# EAGLE design SEGmeterShield (EAGLE 5.11)
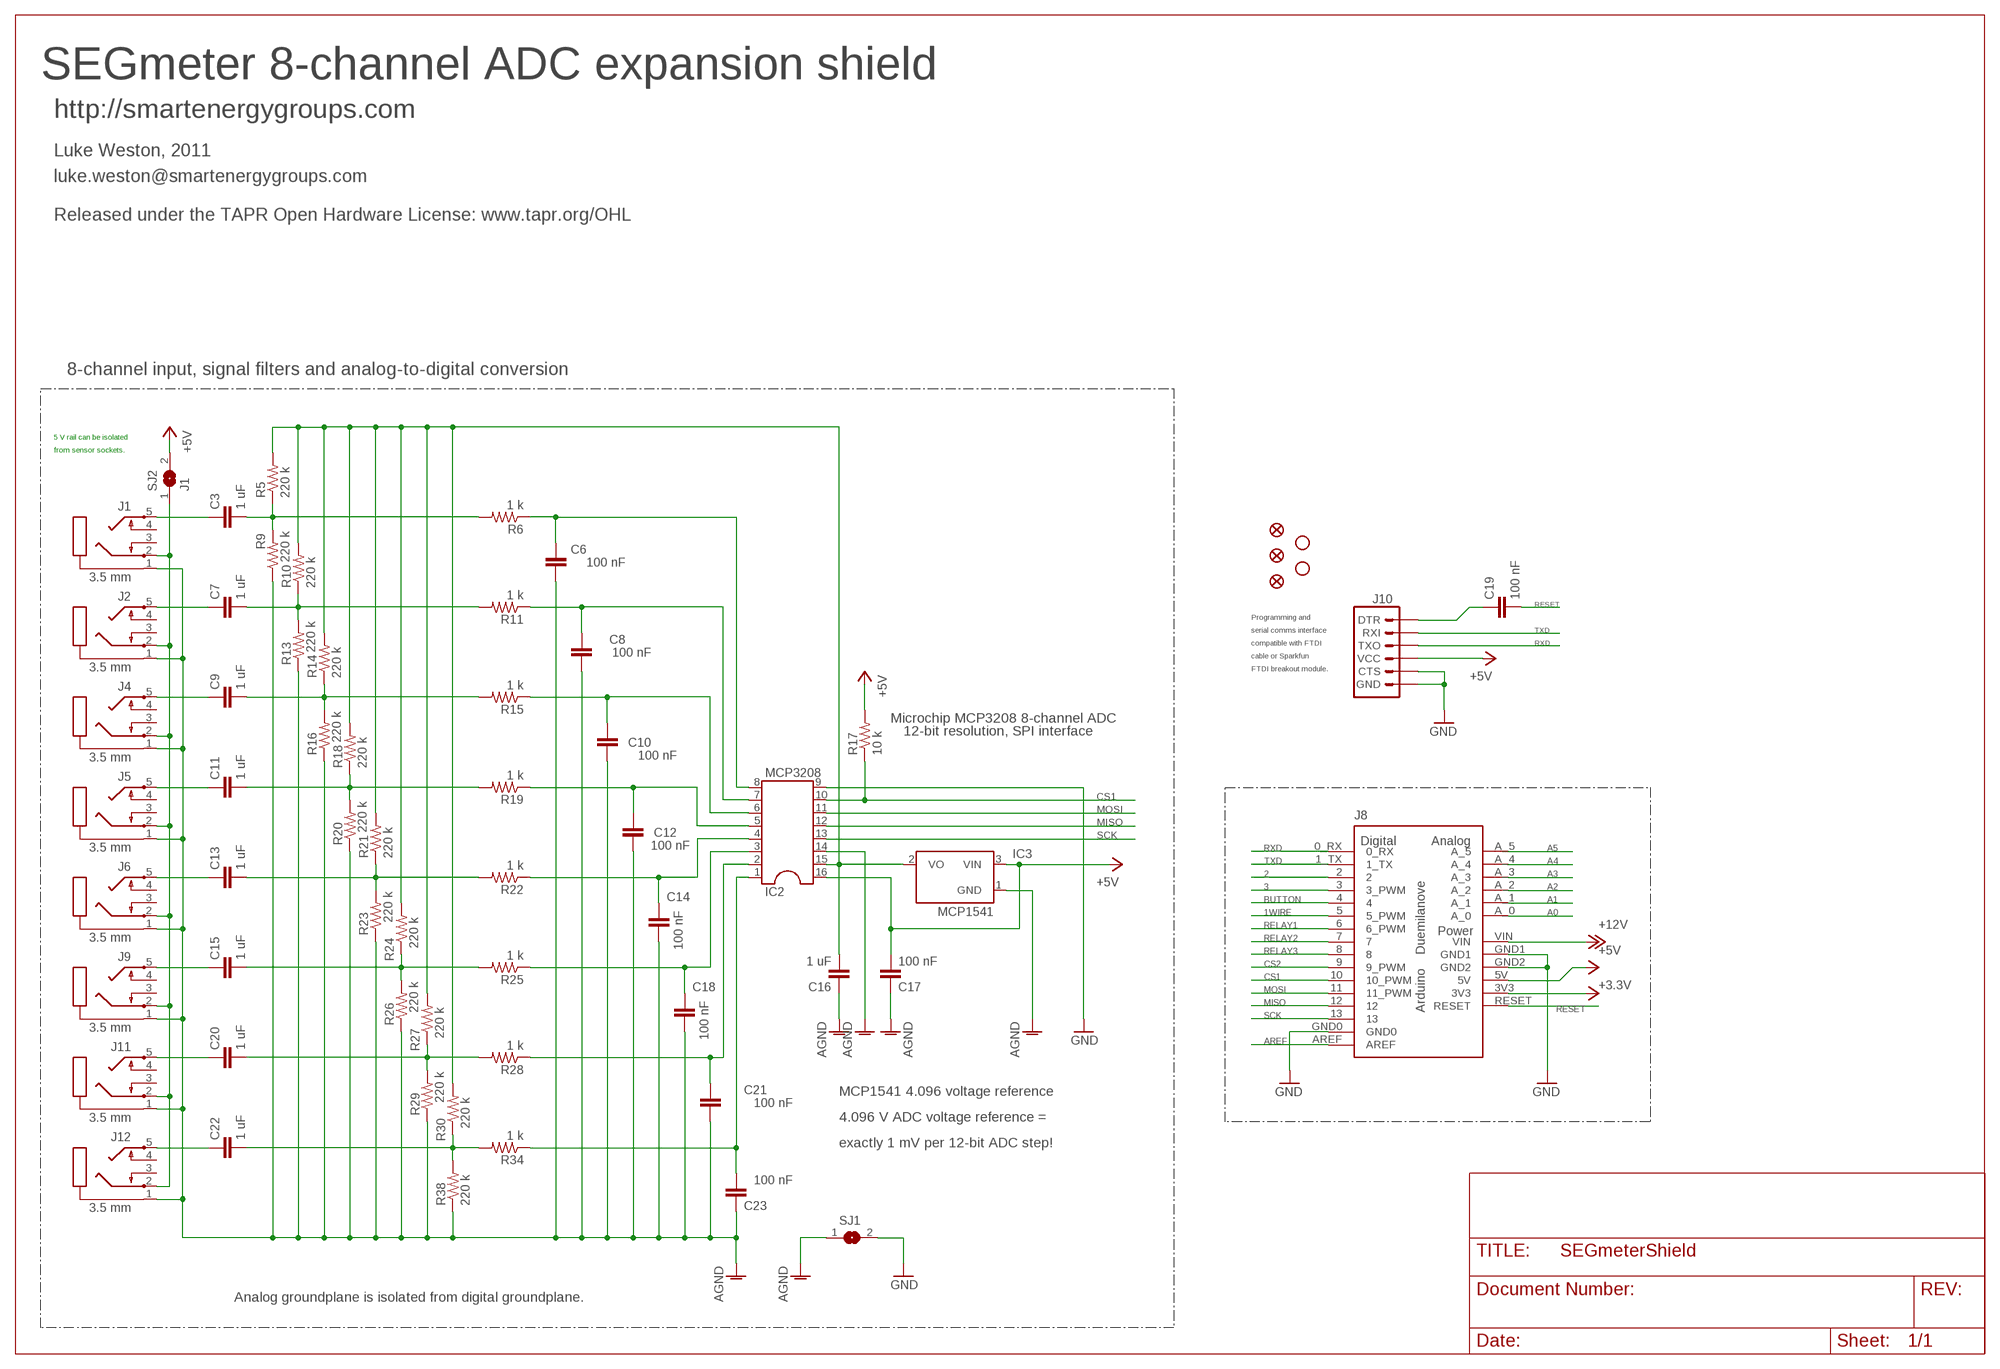
[diagram p0: schematic, sheet 1]

## Parts
C3  1 uF  C-EU050-024X044  [C050-024X044]
C6  100 nF  C-EU050-024X044  [C050-024X044]
C7  1 uF  C-EU050-024X044  [C050-024X044]
C8  100 nF  C-EU050-024X044  [C050-024X044]
C9  1 uF  C-EU050-024X044  [C050-024X044]
C10  100 nF  C-EU050-024X044  [C050-024X044]
C11  1 uF  C-EU050-024X044  [C050-024X044]
C12  100 nF  C-EU050-024X044  [C050-024X044]
C13  1 uF  C-EU050-024X044  [C050-024X044]
C14  100 nF  C-EU050-024X044  [C050-024X044]
C15  1 uF  C-EU050-024X044  [C050-024X044]
C16  1 uF  C-EU050-024X044  [C050-024X044]
C17  100 nF  C-EU050-024X044  [C050-024X044]
C18  100 nF  C-EU050-024X044  [C050-024X044]
C19  100 nF  C-EU050-024X044  [C050-024X044]
C20  1 uF  C-EU050-024X044  [C050-024X044]
C21  100 nF  C-EU050-024X044  [C050-024X044]
C22  1 uF  C-EU050-024X044  [C050-024X044]
C23  100 nF  C-EU050-024X044  [C050-024X044]
IC2  MCP3208  DIL16  [DIL16]
IC3  MCP1541  MC1541TO  [TO92]
J1  3.5 mm  PG203J  [PG203J]
J2  3.5 mm  PG203J  [PG203J]
J4  3.5 mm  PG203J  [PG203J]
J5  3.5 mm  PG203J  [PG203J]
J6  3.5 mm  PG203J  [PG203J]
J8  ARDUINO-USBNO-OUTLINE-NO-TEXT-OCTAGONAL  [NO-OUTLINE-OCTAGONAL-NOTEXT]
J9  3.5 mm  PG203J  [PG203J]
J10  Comms  ARDUINO_SERIAL_PROGRAMLONGPADS  [1X06_LONGPADS]
J11  3.5 mm  PG203J  [PG203J]
J12  3.5 mm  PG203J  [PG203J]
JP1  STAND-OFF  [STAND-OFF]
JP2  FIDUCIAL1.5X3  [FIDUCIAL-1.5X3]
JP3  FIDUCIAL1.5X3  [FIDUCIAL-1.5X3]
JP4  FIDUCIAL1.5X3  [FIDUCIAL-1.5X3]
JP5  STAND-OFF  [STAND-OFF]
R5  220 k  R-US_0207/10  [0207/10]
R6  1 k  R-US_0207/10  [0207/10]
R9  220 k  R-US_0207/10  [0207/10]
R10  220 k  R-US_0207/10  [0207/10]
R11  1 k  R-US_0207/10  [0207/10]
R13  220 k  R-US_0207/10  [0207/10]
R14  220 k  R-US_0207/10  [0207/10]
R15  1 k  R-US_0207/10  [0207/10]
R16  220 k  R-US_0207/10  [0207/10]
R17  10 k  R-US_0207/10  [0207/10]
R18  220 k  R-US_0207/10  [0207/10]
R19  1 k  R-US_0207/10  [0207/10]
R20  220 k  R-US_0207/10  [0207/10]
R21  220 k  R-US_0207/10  [0207/10]
R22  1 k  R-US_0207/10  [0207/10]
R23  220 k  R-US_0207/10  [0207/10]
R24  220 k  R-US_0207/10  [0207/10]
R25  1 k  R-US_0207/10  [0207/10]
R26  220 k  R-US_0207/10  [0207/10]
R27  220 k  R-US_0207/10  [0207/10]
R28  1 k  R-US_0207/10  [0207/10]
R29  220 k  R-US_0207/10  [0207/10]
R30  220 k  R-US_0207/10  [0207/10]
R34  1 k  R-US_0207/10  [0207/10]
R38  220 k  R-US_0207/10  [0207/10]
SJ1  SJ  [SJ]
SJ2  J1  SJ  [SJ]

## Nets
1WIRE: J8.5(5_PWM)
2: J8.2
3: J8.3(3_PWM)
+3.3V: J8.3V3
+5V: C17.2 IC2.16 IC3.3(VIN) J8.5V J10.4(VCC) R17.2 SJ2.2
+12V: J8.VIN
A0: J8.A_0
A1: J8.A_1
A2: J8.A_2
A3: J8.A_3
A4: J8.A_4
A5: J8.A_5
AGND: C6.1 C8.1 C10.1 C12.1 C14.1 C16.1 C17.1 C18.1 C21.1 C23.1 IC2.14 IC3.1(GND) J1.1 J2.1 J4.1 J5.1 J6.1 J9.1 J11.1 J12.1 R9.1 R13.1 R16.1 R20.1 R23.1 R26.1 R29.1 R38.1 SJ1.1
AREF: J8.AREF
BUTTON: J8.4
CS1: IC2.10 J8.10(10_PWM) R17.1
CS2: J8.9(9_PWM)
GND: IC2.9 J8.GND0 J8.GND1 J8.GND2 J10.5(CTS) J10.6(GND) SJ1.2
MISO: IC2.12 J8.12
MOSI: IC2.11 J8.11(11_PWM)
N$1: C3.2 R5.1 R6.2 R9.2
N$2: C20.1 J11.5
N$3: C22.1 J12.5
N$4: C16.2 IC2.15 IC3.2(VO) R5.2 R10.2 R14.2 R18.2 R21.2 R24.2 R27.2 R30.2
N$5: C7.2 R10.1 R11.2 R13.2
N$6: C6.2 IC2.8 R6.1
N$7: C15.1 J9.5
N$8: C13.1 J6.5
N$9: C11.1 J5.5
N$10: C3.1 J1.5
N$11: C7.1 J2.5
N$12: C9.1 J4.5
N$13: C8.2 IC2.7 R11.1
N$14: C10.2 IC2.6 R15.1
N$15: C12.2 IC2.5 R19.1
N$16: C23.2 IC2.1 R34.1
N$17: C21.2 IC2.2 R28.1
N$18: C15.2 R24.1 R25.2 R26.2
N$19: C18.2 IC2.3 R25.1
N$20: C14.2 IC2.4 R22.1
N$21: C22.2 R30.1 R34.2 R38.2
N$22: C20.2 R27.1 R28.2 R29.2
N$24: C13.2 R21.1 R22.2 R23.2
N$26: C11.2 R18.1 R19.2 R20.2
N$27: C9.2 R14.1 R15.2 R16.2
N$30: C19.1 J10.1(DTR)
N$69: J1.2 J2.2 J4.2 J5.2 J6.2 J9.2 J11.2 J12.2 SJ2.1
RELAY1: J8.6(6_PWM)
RELAY2: J8.7
RELAY3: J8.8
RESET: C19.2 J8.RESET
RXD: J8.0_RX J10.3(TXO)
SCK: IC2.13 J8.13
TXD: J8.1_TX J10.2(RXI)
Unconnected: J1.3 J1.4 J2.3 J2.4 J4.3 J4.4 J5.3 J5.4 J6.3 J6.4 J9.3 J9.4 J11.3 J11.4 J12.3 J12.4

## Notes on the sheet
- SEGmeter 8-channel ADC expansion shield
- http://smartenergygroups.com
- Luke Weston, 2011
- luke.weston@smartenergygroups.com
- Released under the TAPR Open Hardware License: www.tapr.org/OHL
- 8-channel input, signal filters and analog-to-digital conversion
- 5 V rail can be isolated
- from sensor sockets.
- Programming and
- serial comms interface
- compatible with FTDI
- cable or Sparkfun
- FTDI breakout module.
- Microchip MCP3208 8-channel ADC
- 12-bit resolution, SPI interface
- MCP1541 4.096 voltage reference
- 4.096 V ADC voltage reference =
- exactly 1 mV per 12-bit ADC step!
- Analog groundplane is isolated from digital groundplane.

## Library data of the parts
C3 C6-C23 = rcl:C-EU: CAPACITOR, European symbol
IC2 = ic-package:DIL16: Dual In Line / Socket
IC3 = microchip:MC15*: 2.5V and 4.096V Voltage References Source: http://www.microchip.com .. 21653b.pdf; OC_FARNELL: unknown; OC_NEWARK: unknown
J1 J2 J4-J6 J9 J11 J12 = con-hirschmann:PG203J: MIC/HEADPHONE JACK KS-S stereo microphone/headphone jack PG203JN (Schukat); OC_FARNELL: unknown; OC_NEWARK: unknown
J8 = Arduino-Various:ARDUINO-USB: The Ardiuno Duemilanove Pinouts layoutet as a Bare Shield. v0.5 Also for Arduino Diecimila. This is designed as a Part and has no Outline in the Dimension Layer. The Outline, when present, is drawed at the tPlace / bPlace Layer. Library by Stephanie Lange, http://www.k-ita.de/~sl/
J10 = SparkFun:ARDUINO_SERIAL_PROGRAM
JP1 JP5 = SparkFun:STAND-OFF: Stand Off This is the mechanical footprint for a #4 phillips button head screw. Use the keepout ring to avoid running the screw head into surrounding components. SKU : PRT-00447
JP2-JP4 = SparkFun:FIDUCIAL: Fiducial Alignment Points Various fiducial points for machine vision alignment.
R5 R6 R9-R11 R13-R30 R34 R38 = rcl:R-US_: RESISTOR, American symbol
SJ1 SJ2 = jumper:SJ: SMD solder JUMPER

## Board
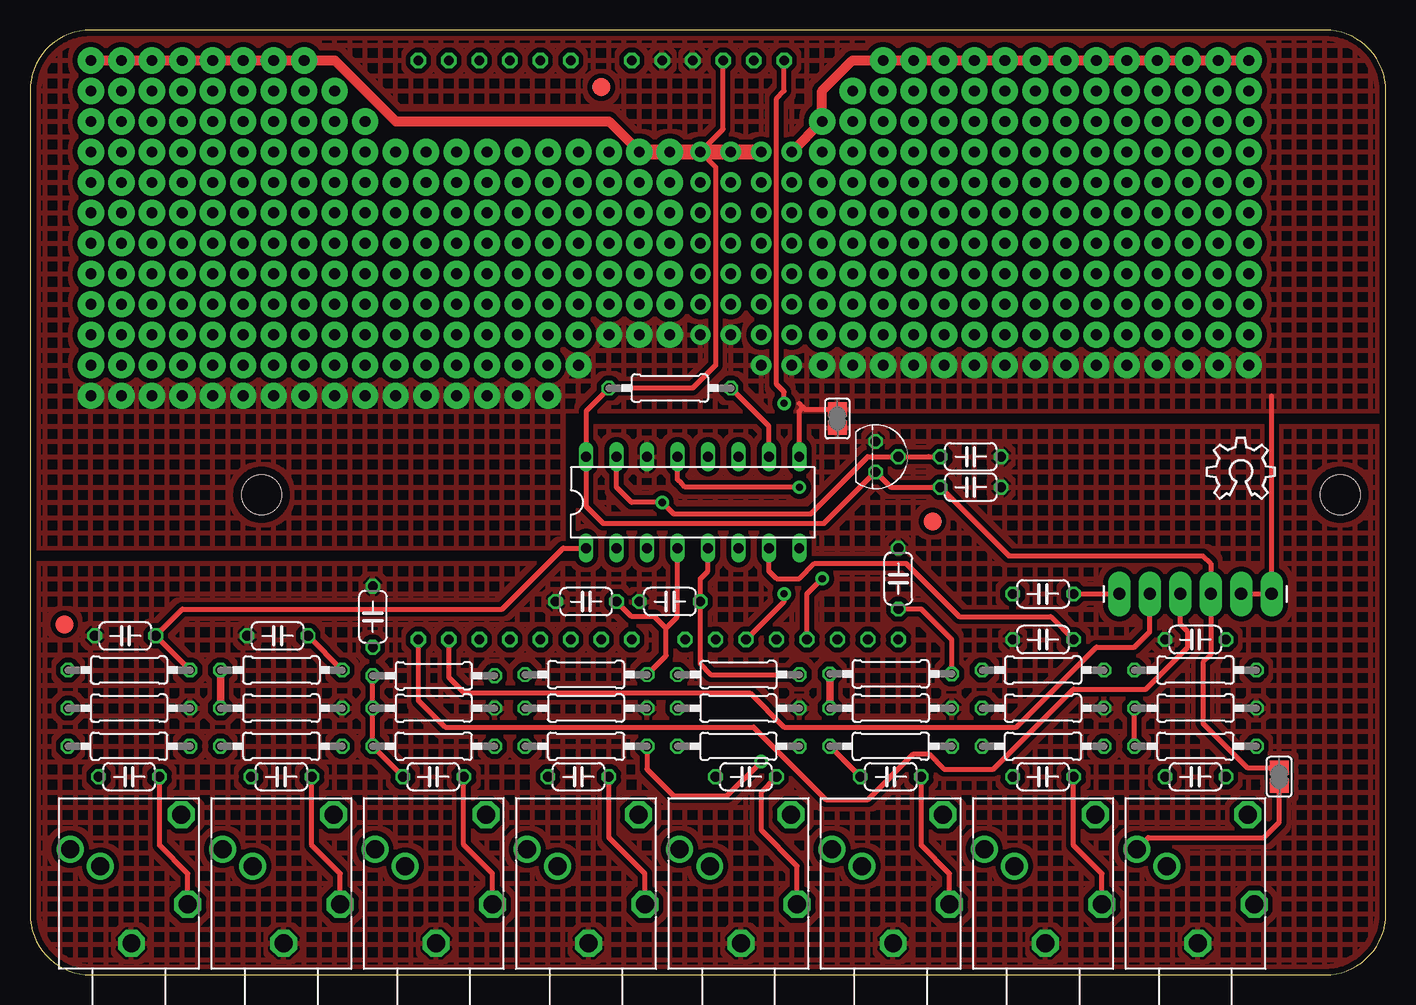
[diagram p1: board, top side]
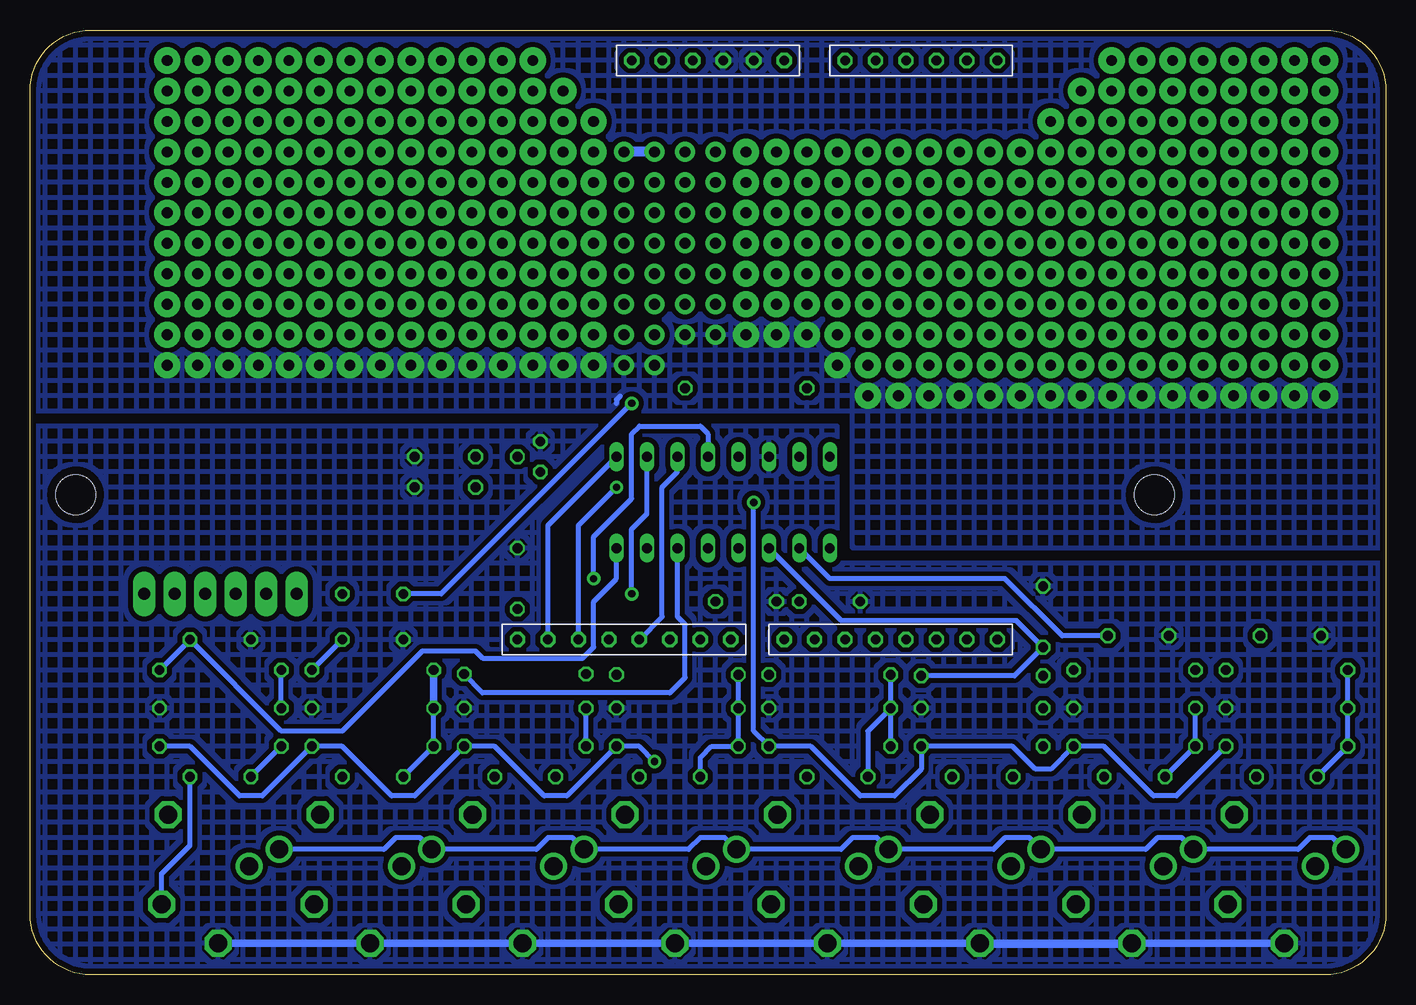
[diagram p2: board, bottom side, seen from below]

Size 113.03 x 78.74 mm. Coordinates in mm from the lower left corner, seen from the top.
Outline: 107.95,0 arc90 113.03,5.08 113.03,73.66 arc90 107.95,78.74 5.08,78.74 arc90 0,73.66 0,5.08 arc90 5.08,0 107.95,0
Copper layers (1*16): Top 0.035mm / dielectric 1.5mm / Bottom 0.035mm
Design rules "PCBCart-Standard": minimum track width 8mil, minimum drill 0.4mm, track to track 8mil, track to pad 8mil, pad to pad 8mil, via to via 8mil, smd to smd 8mil, copper to edge 20mil, drill to drill 8mil, minimum pad ring 8mil, minimum via ring 10mil, stop-mask expansion 3mil, vias tented up to drill 0mil, thermal gap 8mil

### Footprints (pad centres in the part's own frame; a part is rotated, then mirrored left to right if it is on the bottom)
C050-024X044 = drill 0.813 octagon: 1 -2.54,0; 2 2.54,0
DIL16 = drill 0.813 long: 1 -8.89,-3.81; 2 -6.35,-3.81; 3 -3.81,-3.81; 4 -1.27,-3.81; 5 1.27,-3.81; 6 3.81,-3.81; 7 6.35,-3.81; 8 8.89,-3.81; 9 8.89,3.81; 10 6.35,3.81; 11 3.81,3.81; 12 1.27,3.81; 13 -1.27,3.81; 14 -3.81,3.81; 15 -6.35,3.81; 16 -8.89,3.81
TO92 = drill 0.813 octagon: 1 -1.27,0; 2 0,1.905; 3 1.27,0
PG203J = drill 1.499 octagon: 1 -5.004,-0.203; 4 5.74,-4.369; 5 -1.753,-4.902 | drill 1.499 round: 2 2.845,4.902; 3 1.448,2.388
NO-OUTLINE-OCTAGONAL-NOTEXT = drill 0.8 pad 1.27 octagon: 0_RX -25.4,27.94; 1_TX -25.4,25.4; 2 -25.4,22.86; 3 -25.4,20.32; 3V3 22.86,0; 4 -25.4,17.78; 5 -25.4,15.24; 5V 22.86,2.54; 6 -25.4,12.7; 7 -25.4,10.16; 8 -25.4,5.715; 9 -25.4,3.175; 10 -25.4,0.635; 11 -25.4,-1.905; 12 -25.4,-4.445; 13 -25.4,-6.985; A_0 22.86,15.24; A_1 22.86,17.78; A_2 22.86,20.32; A_3 22.86,22.86; A_4 22.86,25.4; A_5 22.86,27.94; AREF -25.4,-12.065; GND0 -25.4,-9.525; GND1 22.86,7.62; GND2 22.86,5.08; RESET 22.86,-2.54; VIN 22.86,10.16
1X06_LONGPADS = drill 1.016 pad 1.88 long: 1 0,0; 2 2.54,0; 3 5.08,0; 4 7.62,0; 5 10.16,0; 6 12.7,0
STAND-OFF = hole 3.302: 0,0
FIDUCIAL-1.5X3 = smd 1.5 x 1.5: 1 0,0
0207/10 = drill 0.813 octagon: 1 -5.08,0; 2 5.08,0
SJ = smd 1.168 x 1.6: 1 -0.762,0; 2 0.762,0

### Placement (x,y rotation side)
C3  97.16,16.51 180 top
C6  97.16,27.94 0 top
C7  84.46,16.51 180 top
C8  84.46,27.94 0 top
C9  71.76,16.51 180 top
C10  72.39,33.02 270 top
C11  59.69,16.51 180 top
C12  53.34,31.11 0 top
C13  45.72,16.51 180 top
C14  46.35,31.11 0 top
C15  33.62,16.51 180 top
C16  78.42,43.18 180 top
C17  78.42,40.64 180 top
C18  28.57,29.84 270 top
C19  84.45,31.75 180 top
C20  20.95,16.51 180 top
C21  20.64,28.26 0 top
C22  8.25,16.51 180 top
C23  7.94,28.26 0 top
IC2  55.24,39.37 0 top
IC3  70.48,43.18 270 top
J1  97.16,7.62 90 top
J2  84.46,7.62 90 top
J4  71.76,7.62 90 top
J5  59.05,7.62 90 top
J6  46.35,7.62 90 top
J8  60.32,53.34 90 top
J9  33.66,7.62 90 top
J10  90.81,31.75 0 top
J11  20.95,7.62 90 top
J12  8.25,7.62 90 top
JP1  19.3,40.01 0 top
JP2  75.25,37.78 0 top
JP3  47.62,73.98 0 top
JP4  2.86,29.21 0 top
JP5  109.22,40.01 0 top
R5  97.16,19.05 0 top
R6  97.16,25.4 180 top
R9  97.16,22.22 180 top
R10  84.46,19.05 0 top
R11  84.46,25.4 180 top
R13  84.46,22.22 180 top
R14  71.76,19.05 0 top
R15  71.76,25.08 180 top
R16  71.76,22.22 180 top
R17  53.34,48.89 180 top
R18  59.05,19.05 0 top
R19  59.05,25.02 180 top
R20  59.05,22.22 180 top
R21  46.35,19.05 0 top
R22  46.35,25.02 180 top
R23  46.35,22.22 180 top
R24  33.66,19.05 0 top
R25  33.65,24.92 180 top
R26  33.66,22.22 180 top
R27  20.95,19.05 0 top
R28  20.95,25.4 180 top
R29  20.95,22.22 180 top
R30  8.25,19.05 0 top
R34  8.25,25.4 180 top
R38  8.25,22.22 180 top
SJ1  67.31,46.35 90 top
SJ2  104.14,16.51 90 top
U$1  [OSHW_8X200_NOTEXT]  98.11,39.69 0 top

### Tracks (layer width: path | path; a pad name or v marks a point on that pad's centre or on a via)
+5V  (via drill 0.9 pad 1.68, 0.9 pad 2.18)
  Top 0.406: IC3.3 71.76,40.64 C17.2 81.6,34.92 97.79,34.92 98.43,34.29 J10.4 98.43,26.67 97.79,26.04 97.79,20.95 101.47,17.27 SJ2.2 | IC3.3 | IC3.3 66.2,37.62 47.78,37.62 46.35,39.05 IC2.16 46.35,46.99 R17.2 55.24,48.89 57.15,50.8 57.15,67.31 v55.88,68.58 57.78,70.48 J8.5V
  Top 0.813: v5.08,76.2 v7.62,76.2 v10.16,76.2 v12.7,76.2 v15.24,76.2 v17.78,76.2 v20.32,76.2 v22.86,76.2 25.4,76.2 30.48,71.12 48.26,71.12 v50.8,68.58 | v101.6,76.2 v99.06,76.2 v96.52,76.2 v93.98,76.2 v91.44,76.2 v88.9,76.2 v86.36,76.2 v83.82,76.2 v81.28,76.2 v78.74,76.2 v76.2,76.2 v73.66,76.2 v71.12,76.2 68.58,76.2 66.04,73.66 v66.04,71.12 v63.5,68.58
  Top 1.27: v50.8,68.58 v53.34,68.58 v55.88,68.58 v58.42,68.58 v60.96,68.58
  Bottom 0.406: IC3.3
  Bottom 0.813: v60.96,68.58 v63.5,68.58
AGND
  Bottom 0.61: J1.1 J2.1 J4.1 59.77,2.62 59.69,2.54 59.33,2.54 J5.1 J6.1 J9.1 | J9.1 34.21,2.62 34.29,2.54 33.02,2.54 | J9.1 J11.1 J12.1 | 33.02,2.54 21.59,2.54 | J9.1 33.1,2.62 33.02,2.54
  pour Bottom (isolate 0.406, hatched): -1.27,34.29 45.72,34.29 45.72,45.72 113.67,45.72 113.67,-0.63 -1.27,-0.63
  pour Top (isolate 0.406, hatched): -1.27,34.29 45.72,34.29 45.72,45.72 113.67,45.72 113.67,-0.63 -1.27,-0.63
CS1  (via drill 0.6)
  Top 0.406: J8.10 62.87,31.11 v62.87,31.75 | R17.1 61.59,45.72 IC2.10
  Bottom 0.406: IC2.10 61.59,38.42 62.87,37.15 v62.87,31.75
GND  (via drill 0.9 pad 1.68, 0.9 pad 2.18)
  Top 0.406: 103.51,48.26 J10.6 J10.5 | SJ1.2 64.64,47.12 64.45,47.31 | 64.45,47.31 64.14,47.62 | IC2.9 64.14,46.99 64.45,47.31
  Bottom 0.406: 63.82,48.26 64.14,47.94 64.14,47.62 | J8.GND0 69.85,37.46 IC2.9
  other vias: 5.08,48.26 7.62,48.26 10.16,48.26 12.7,48.26 15.24,48.26 17.78,48.26 40.64,48.26 43.18,48.26 35.56,48.26 38.1,48.26 30.48,48.26 33.02,48.26 27.94,48.26 25.4,48.26 22.86,48.26 20.32,48.26 63.5,50.8 60.96,50.8 58.42,53.34 55.88,53.34 48.26,53.34 45.72,50.8 50.8,53.34 53.34,53.34 66.04,50.8 68.58,50.8 71.12,50.8 73.66,50.8 76.2,50.8 78.74,50.8 81.28,50.8 83.82,50.8 86.36,50.8 88.9,50.8 91.44,50.8 93.98,50.8 96.52,50.8 99.06,50.8 101.6,50.8
  pour Bottom (isolate 0.406, hatched): -1.27,35.56 44.45,35.56 44.45,46.99 113.67,46.99 113.67,79.38 -1.32,79.4
  pour Top (isolate 0.406, hatched): -1.27,79.69 113.98,79.69 113.98,46.99 44.45,46.99 44.45,35.56 -1.27,35.56
MISO  (via drill 0.6)
  Top 0.406: J8.12 64.77,31.75 v66.04,33.02
  Bottom 0.406: v66.04,33.02 66.04,36.51 62.87,39.69 62.87,45.09 62.23,45.72 57.15,45.72 56.52,45.09 IC2.12
MOSI
  Bottom 0.406: IC2.11 59.05,41.91 60.32,40.64 60.32,29.84 J8.11
N$1
  Top 0.406: R5.1 R9.2
  Bottom 0.406: R5.1 C3.2 | R9.2 R6.2
N$2
  Top 0.406: J11.5 25.86,8.43 23.49,10.8 C20.1
N$3
  Top 0.406: J12.5 13.16,8.43 10.8,10.8 C22.1
N$4  (via drill 0.6)
  Top 0.406: IC2.15 48.89,40.64 50.16,39.37 v52.7,39.37 53.66,38.42 65.09,38.42 69.85,43.18 IC3.2 74.93,43.18 C16.2 | R21.2 51.44,17.14 53.66,14.92 58.1,14.92 v60.96,17.78
  Bottom 0.406: R5.2 99.7,19.05 95.57,14.92 93.66,14.92 R10.2 87,19.05 82.87,14.92 80.96,14.92 R14.2 74.3,19.05 70.17,14.92 68.26,14.92 R18.2 62.23,19.05 v60.96,17.78 | v52.7,39.37 52.7,20.32 R21.2 47.94,19.05 43.81,14.92 40.96,14.92 38.73,17.14 R24.2 31.11,19.05 29.21,17.14 27.94,17.14 R27.2 23.49,19.05 19.37,14.92 17.46,14.92 R30.2
N$5
  Bottom 0.406: R13.2 R10.1 C7.2
  Bottom 0.61: R13.2 R11.2
N$6
  Bottom 0.406: R6.1 C6.2 92.08,20.32 87,20.32 80.33,26.99 75.88,26.99 75.25,26.35 66.99,26.35 66.04,27.3 66.04,31.11 64.14,33.02 IC2.8
N$7
  Top 0.406: J9.5 38.56,8.43 36.2,10.8 36.16,10.83 C15.1
N$8
  Top 0.406: J6.5 51.26,8.43 48.26,11.43 C13.1
N$9
  Top 0.406: J5.5 63.96,9.07 60.96,12.07 60.96,15.24 C11.1
N$10
  Bottom 0.406: J1.5 102.06,8.43 99.7,10.8 C3.1
N$11
  Top 0.406: J2.5 89.36,8.43 87,10.8 C7.1
N$12
  Top 0.406: J4.5 76.66,8.43 74.3,10.8 C9.1
N$13
  Top 0.406: IC2.7 61.59,33.66 62.23,33.02 64.14,33.02 65.41,34.29 73.03,34.29 77.47,29.84 85.09,29.84 C8.2
  Bottom 0.406: C8.2 R11.1
N$14
  Top 0.406: R15.1 76.84,27.94 74.3,30.48 C10.2 | C10.2
  Bottom 0.406: IC2.6 59.05,29.84 58.42,29.21 58.42,24.77 59.69,23.49 75.31,23.49 R15.1
N$15
  Top 0.406: IC2.5 56.52,33.66 55.88,33.02 C12.2 55.88,25.91 56.77,25.02 R19.1
N$16
  Top 0.406: R34.1 C23.2 12.7,30.48 39.37,30.48 44.45,35.56 IC2.1
N$17
  Top 0.406: C21.2 R28.1
  Bottom 0.406: IC2.2 46.35,33.02 31.75,33.02 26.99,28.26 C21.2
N$18
  Top 0.406: R26.2 R25.2 | R26.2 | R26.2 R24.1 31.08,16.54 C15.2
N$19
  Bottom 0.406: IC2.3 45.4,29.53 30.8,29.53 C18.2 30.96,24.92 R25.1
N$20
  Top 0.406: IC2.4 53.98,29.84 53.02,28.89 | 53.02,28.89 53.02,26.61 R22.1 | C14.2 50.16,29.84 52.07,29.84 53.02,28.89
N$21
  Bottom 0.406: C22.2 R30.1 R38.2 R34.2
N$22
  Top 0.61: R29.2 R28.2
  Bottom 0.406: R29.2 R27.1 C20.2
N$23  (via drill 0.9 pad 2.18)
  other vias: 5.08,73.66
N$24
  Bottom 0.406: R21.1 R23.2 | R23.2 R22.2 | C13.2 43.18,20.32 R23.2
N$25  (via drill 0.9 pad 2.18)
  other vias: 7.62,73.66
N$26
  Bottom 0.406: R19.2 R20.2 R18.1 56.2,19.05 57.15,18.1 C11.2
N$27
  Top 0.406: R14.1 C9.2
  Top 0.61: R16.2 R15.2
  Bottom 0.406: R14.1 R16.2
N$28  (via drill 0.9 pad 2.18)
  other vias: 5.08,71.12
N$29  (via drill 0.9 pad 2.18)
  other vias: 5.08,68.58
N$30
  Top 0.406: C19.1 J10.1
  Top 0.61: J10.1
N$31  (via drill 0.9 pad 2.18)
  other vias: 5.08,66.04
N$32  (via drill 0.9 pad 2.18)
  other vias: 45.72,66.04
N$33  (via drill 0.9 pad 2.18)
  other vias: 45.72,63.5
N$34  (via drill 0.9 pad 2.18)
  other vias: 45.72,60.96
N$35  (via drill 0.9 pad 2.18)
  other vias: 45.72,58.42
N$36  (via drill 0.9 pad 2.18)
  other vias: 43.18,58.42
N$37  (via drill 0.9 pad 2.18)
  other vias: 40.64,58.42
N$38  (via drill 0.9 pad 2.18)
  other vias: 38.1,58.42
N$39  (via drill 0.9 pad 2.18)
  other vias: 38.1,60.96
N$40  (via drill 0.9 pad 2.18)
  other vias: 38.1,63.5
N$41  (via drill 0.9 pad 2.18)
  other vias: 35.56,66.04
N$42  (via drill 0.9 pad 2.18)
  other vias: 35.56,63.5
N$43  (via drill 0.9 pad 2.18)
  other vias: 35.56,60.96
N$44  (via drill 0.9 pad 2.18)
  other vias: 35.56,58.42
N$45  (via drill 0.9 pad 2.18)
  other vias: 38.1,66.04
N$46  (via drill 0.9 pad 2.18)
  other vias: 40.64,66.04
N$47  (via drill 0.9 pad 2.18)
  other vias: 43.18,66.04
N$48  (via drill 0.9 pad 2.18)
  other vias: 43.18,63.5
N$49  (via drill 0.9 pad 2.18)
  other vias: 40.64,63.5
N$50  (via drill 0.9 pad 2.18)
  other vias: 40.64,60.96
N$51  (via drill 0.9 pad 2.18)
  other vias: 43.18,60.96
N$52  (via drill 0.9 pad 2.18)
  other vias: 10.16,73.66
N$53  (via drill 0.9 pad 2.18)
  other vias: 5.08,63.5
N$54  (via drill 0.9 pad 2.18)
  other vias: 5.08,60.96
N$55  (via drill 0.9 pad 2.18)
  other vias: 68.58,73.66
N$56  (via drill 0.9 pad 2.18)
  other vias: 68.58,71.12
N$57  (via drill 0.9 pad 2.18)
  other vias: 68.58,68.58
N$58  (via drill 0.9 pad 2.18)
  other vias: 33.02,66.04
N$59  (via drill 0.9 pad 2.18)
  other vias: 30.48,66.04
N$60  (via drill 0.9 pad 2.18)
  other vias: 27.94,66.04
N$61  (via drill 0.9 pad 2.18)
  other vias: 25.4,66.04
N$62  (via drill 0.9 pad 2.18)
  other vias: 22.86,66.04
N$63  (via drill 0.9 pad 2.18)
  other vias: 20.32,66.04
N$64  (via drill 0.9 pad 2.18)
  other vias: 43.18,50.8
N$65  (via drill 0.9 pad 2.18)
  other vias: 45.72,53.34
N$66  (via drill 0.9 pad 2.18)
  other vias: 48.26,68.58
N$67  (via drill 0.9 pad 2.18)
  other vias: 66.04,68.58
N$68  (via drill 0.9 pad 2.18)
  other vias: 27.94,71.12
N$69
  Top 0.406: SJ2.1 104.14,12.7 102.87,11.43 93.22,11.43 J1.2
  Bottom 0.406: J12.2 3.48,10.46 4.45,11.43 6.35,11.43 7.32,10.46 J11.2 17.02,11.43 19.05,11.43 20.02,10.46 J9.2 29.72,11.43 31.75,11.43 32.72,10.46 J6.2 42.42,11.43 44.45,11.43 45.41,10.46 J5.2 55.12,11.43 57.15,11.43 58.12,10.46 J4.2 67.82,11.43 69.85,11.43 70.82,10.46 J2.2 80.52,11.43 82.55,11.43 83.52,10.46 J1.2
N$70  (via drill 0.9 pad 1.68)
  other vias: 60.96,53.34
N$71  (via drill 0.9 pad 2.18)
  other vias: 17.78,66.04
N$72  (via drill 0.9 pad 2.18)
  other vias: 5.08,50.8
N$73  (via drill 0.9 pad 2.18)
  other vias: 5.08,53.34
N$74  (via drill 0.9 pad 2.18)
  other vias: 5.08,55.88
N$75  (via drill 0.9 pad 2.18)
  other vias: 5.08,58.42
N$76  (via drill 0.9 pad 2.18)
  other vias: 15.24,66.04
N$77  (via drill 0.9 pad 2.18)
  other vias: 12.7,66.04
N$78  (via drill 0.9 pad 2.18)
  other vias: 43.18,53.34
N$79  (via drill 0.9 pad 2.18)
  other vias: 33.02,63.5
N$80  (via drill 0.9 pad 2.18)
  other vias: 33.02,60.96
N$81  (via drill 0.9 pad 2.18)
  other vias: 33.02,58.42
N$82  (via drill 0.9 pad 2.18)
  other vias: 30.48,58.42
N$83  (via drill 0.9 pad 2.18)
  other vias: 27.94,58.42
N$84  (via drill 0.9 pad 2.18)
  other vias: 27.94,60.96
N$85  (via drill 0.9 pad 2.18)
  other vias: 27.94,63.5
N$86  (via drill 0.9 pad 2.18)
  other vias: 25.4,63.5
N$87  (via drill 0.9 pad 1.68)
  other vias: 63.5,53.34
N$88  (via drill 0.9 pad 2.18)
  other vias: 25.4,60.96
N$92  (via drill 0.9 pad 2.18)
  other vias: 66.04,58.42
N$94  (via drill 0.9 pad 2.18)
  other vias: 101.6,53.34
N$95  (via drill 0.9 pad 2.18)
  other vias: 101.6,55.88
N$97  (via drill 0.9 pad 2.18)
  other vias: 101.6,73.66
N$104  (via drill 0.9 pad 2.18)
  other vias: 73.66,53.34
N$105  (via drill 0.9 pad 2.18)
  other vias: 76.2,53.34
N$106  (via drill 0.9 pad 2.18)
  other vias: 78.74,53.34
N$107  (via drill 0.9 pad 2.18)
  other vias: 81.28,53.34
N$108  (via drill 0.9 pad 2.18)
  other vias: 83.82,53.34
N$109  (via drill 0.9 pad 2.18)
  other vias: 86.36,53.34
N$110  (via drill 0.9 pad 2.18)
  other vias: 88.9,55.88
N$111  (via drill 0.9 pad 2.18)
  other vias: 91.44,55.88
N$117  (via drill 0.9 pad 2.18)
  other vias: 66.04,53.34
N$118  (via drill 0.9 pad 2.18)
  other vias: 25.4,58.42
N$119  (via drill 0.9 pad 2.18)
  other vias: 30.48,60.96
N$120  (via drill 0.9 pad 2.18)
  other vias: 30.48,63.5
N$121  (via drill 0.9 pad 2.18)
  other vias: 40.64,50.8
N$122  (via drill 0.9 pad 2.18)
  other vias: 12.7,58.42
N$123  (via drill 0.9 pad 2.18)
  other vias: 12.7,60.96
N$124  (via drill 0.9 pad 2.18)
  other vias: 7.62,50.8
N$125  (via drill 0.9 pad 2.18)
  other vias: 12.7,63.5
N$126  (via drill 0.9 pad 2.18)
  other vias: 17.78,63.5
N$127  (via drill 0.9 pad 2.18)
  other vias: 15.24,63.5
N$128  (via drill 0.9 pad 2.18)
  other vias: 15.24,60.96
N$129  (via drill 0.9 pad 2.18)
  other vias: 15.24,58.42
N$130  (via drill 0.9 pad 2.18)
  other vias: 17.78,58.42
N$131  (via drill 0.9 pad 2.18)
  other vias: 17.78,60.96
N$132  (via drill 0.9 pad 2.18)
  other vias: 20.32,60.96
N$133  (via drill 0.9 pad 2.18)
  other vias: 20.32,63.5
N$134  (via drill 0.9 pad 2.18)
  other vias: 7.62,71.12
N$135  (via drill 0.9 pad 2.18)
  other vias: 22.86,63.5
N$136  (via drill 0.9 pad 2.18)
  other vias: 22.86,60.96
N$140  (via drill 0.9 pad 2.18)
  other vias: 71.12,73.66
N$141  (via drill 0.9 pad 2.18)
  other vias: 99.06,73.66
N$142  (via drill 0.9 pad 2.18)
  other vias: 101.6,71.12
N$144  (via drill 0.9 pad 2.18)
  other vias: 68.58,53.34
N$145  (via drill 0.9 pad 2.18)
  other vias: 22.86,58.42
N$146  (via drill 0.9 pad 2.18)
  other vias: 20.32,58.42
N$147  (via drill 0.9 pad 2.18)
  other vias: 71.12,53.34
N$148  (via drill 0.9 pad 2.18)
  other vias: 101.6,58.42
N$149  (via drill 0.9 pad 2.18)
  other vias: 101.6,60.96
N$150  (via drill 0.9 pad 2.18)
  other vias: 101.6,63.5
N$151  (via drill 0.9 pad 2.18)
  other vias: 101.6,66.04
N$152  (via drill 0.9 pad 2.18)
  other vias: 101.6,68.58
N$153  (via drill 0.9 pad 2.18)
  other vias: 45.72,68.58
N$154  (via drill 0.9 pad 2.18)
  other vias: 25.4,73.66
N$155  (via drill 0.9 pad 1.68)
  other vias: 55.88,66.04
N$156  (via drill 0.9 pad 2.18)
  other vias: 66.04,66.04
N$157  (via drill 0.9 pad 1.68)
  other vias: 63.5,66.04
N$158  (via drill 0.9 pad 1.68)
  other vias: 60.96,66.04
N$159  (via drill 0.9 pad 1.68)
  other vias: 58.42,66.04
N$160  (via drill 0.9 pad 1.68)
  other vias: 55.88,55.88
N$161  (via drill 0.9 pad 1.68)
  other vias: 63.5,55.88
N$162  (via drill 0.9 pad 2.18)
  other vias: 66.04,55.88
N$163  (via drill 0.9 pad 1.68)
  other vias: 60.96,55.88
N$164  (via drill 0.9 pad 1.68)
  other vias: 58.42,55.88
N$165  (via drill 0.9 pad 1.68)
  other vias: 58.42,58.42
N$166  (via drill 0.9 pad 1.68)
  other vias: 55.88,58.42
N$167  (via drill 0.9 pad 1.68)
  other vias: 55.88,60.96
N$168  (via drill 0.9 pad 1.68)
  other vias: 55.88,63.5
N$169  (via drill 0.9 pad 1.68)
  other vias: 58.42,63.5
N$170  (via drill 0.9 pad 1.68)
  other vias: 58.42,60.96
N$171  (via drill 0.9 pad 1.68)
  other vias: 63.5,60.96
N$172  (via drill 0.9 pad 1.68)
  other vias: 63.5,58.42
N$173  (via drill 0.9 pad 1.68)
  other vias: 60.96,58.42
N$174  (via drill 0.9 pad 1.68)
  other vias: 60.96,60.96
N$175  (via drill 0.9 pad 1.68)
  other vias: 60.96,63.5
N$176  (via drill 0.9 pad 1.68)
  other vias: 63.5,63.5
N$181  (via drill 0.9 pad 2.18)
  other vias: 99.06,53.34
N$182  (via drill 0.9 pad 2.18)
  other vias: 96.52,53.34
N$183  (via drill 0.9 pad 2.18)
  other vias: 93.98,53.34
N$184  (via drill 0.9 pad 2.18)
  other vias: 91.44,53.34
N$185  (via drill 0.9 pad 2.18)
  other vias: 88.9,53.34
N$186  (via drill 0.9 pad 2.18)
  other vias: 93.98,55.88
N$187  (via drill 0.9 pad 2.18)
  other vias: 96.52,55.88
N$188  (via drill 0.9 pad 2.18)
  other vias: 99.06,55.88
N$189  (via drill 0.9 pad 2.18)
  other vias: 99.06,58.42
N$190  (via drill 0.9 pad 2.18)
  other vias: 99.06,60.96
N$191  (via drill 0.9 pad 2.18)
  other vias: 96.52,60.96
N$192  (via drill 0.9 pad 2.18)
  other vias: 96.52,58.42
N$193  (via drill 0.9 pad 2.18)
  other vias: 93.98,58.42
N$194  (via drill 0.9 pad 2.18)
  other vias: 93.98,60.96
N$195  (via drill 0.9 pad 2.18)
  other vias: 91.44,60.96
N$196  (via drill 0.9 pad 2.18)
  other vias: 88.9,60.96
N$197  (via drill 0.9 pad 2.18)
  other vias: 88.9,58.42
N$198  (via drill 0.9 pad 2.18)
  other vias: 91.44,58.42
N$199  (via drill 0.9 pad 2.18)
  other vias: 86.36,55.88
N$200  (via drill 0.9 pad 2.18)
  other vias: 83.82,55.88
N$201  (via drill 0.9 pad 2.18)
  other vias: 81.28,55.88
N$202  (via drill 0.9 pad 2.18)
  other vias: 78.74,55.88
N$203  (via drill 0.9 pad 2.18)
  other vias: 76.2,55.88
N$204  (via drill 0.9 pad 2.18)
  other vias: 73.66,55.88
N$205  (via drill 0.9 pad 2.18)
  other vias: 71.12,55.88
N$206  (via drill 0.9 pad 2.18)
  other vias: 68.58,55.88
N$207  (via drill 0.9 pad 2.18)
  other vias: 66.04,60.96
N$208  (via drill 0.9 pad 2.18)
  other vias: 66.04,63.5
N$209  (via drill 0.9 pad 2.18)
  other vias: 68.58,66.04
N$210  (via drill 0.9 pad 2.18)
  other vias: 68.58,63.5
N$211  (via drill 0.9 pad 2.18)
  other vias: 68.58,60.96
N$212  (via drill 0.9 pad 2.18)
  other vias: 68.58,58.42
N$213  (via drill 0.9 pad 2.18)
  other vias: 71.12,71.12
N$214  (via drill 0.9 pad 2.18)
  other vias: 73.66,71.12
N$215  (via drill 0.9 pad 2.18)
  other vias: 73.66,73.66
N$216  (via drill 0.9 pad 2.18)
  other vias: 93.98,73.66
N$217  (via drill 0.9 pad 2.18)
  other vias: 96.52,73.66
N$218  (via drill 0.9 pad 2.18)
  other vias: 96.52,71.12
N$219  (via drill 0.9 pad 2.18)
  other vias: 99.06,71.12
N$220  (via drill 0.9 pad 2.18)
  other vias: 99.06,68.58
N$221  (via drill 0.9 pad 2.18)
  other vias: 99.06,66.04
N$222  (via drill 0.9 pad 2.18)
  other vias: 99.06,63.5
N$223  (via drill 0.9 pad 2.18)
  other vias: 91.44,73.66
N$224  (via drill 0.9 pad 2.18)
  other vias: 88.9,73.66
N$225  (via drill 0.9 pad 2.18)
  other vias: 86.36,73.66
N$226  (via drill 0.9 pad 2.18)
  other vias: 83.82,73.66
N$227  (via drill 0.9 pad 2.18)
  other vias: 76.2,73.66
N$228  (via drill 0.9 pad 2.18)
  other vias: 78.74,73.66
N$229  (via drill 0.9 pad 2.18)
  other vias: 81.28,73.66
N$230  (via drill 0.9 pad 2.18)
  other vias: 71.12,68.58
N$231  (via drill 0.9 pad 2.18)
  other vias: 7.62,68.58
N$232  (via drill 0.9 pad 2.18)
  other vias: 10.16,71.12
N$233  (via drill 0.9 pad 2.18)
  other vias: 12.7,71.12
N$234  (via drill 0.9 pad 2.18)
  other vias: 12.7,73.66
N$235  (via drill 0.9 pad 2.18)
  other vias: 15.24,73.66
N$236  (via drill 0.9 pad 2.18)
  other vias: 17.78,73.66
N$237  (via drill 0.9 pad 2.18)
  other vias: 20.32,73.66
N$238  (via drill 0.9 pad 2.18)
  other vias: 22.86,73.66
N$239  (via drill 0.9 pad 2.18)
  other vias: 22.86,71.12
N$240  (via drill 0.9 pad 2.18)
  other vias: 25.4,71.12
N$241  (via drill 0.9 pad 2.18)
  other vias: 27.94,68.58
N$242  (via drill 0.9 pad 2.18)
  other vias: 30.48,68.58
N$243  (via drill 0.9 pad 2.18)
  other vias: 96.52,68.58
N$244  (via drill 0.9 pad 2.18)
  other vias: 96.52,66.04
N$245  (via drill 0.9 pad 2.18)
  other vias: 96.52,63.5
N$246  (via drill 0.9 pad 2.18)
  other vias: 17.78,71.12
N$247  (via drill 0.9 pad 2.18)
  other vias: 10.16,68.58
N$248  (via drill 0.9 pad 2.18)
  other vias: 7.62,66.04
N$249  (via drill 0.9 pad 2.18)
  other vias: 15.24,71.12
N$250  (via drill 0.9 pad 2.18)
  other vias: 20.32,71.12
N$251  (via drill 0.9 pad 2.18)
  other vias: 33.02,68.58
N$252  (via drill 0.9 pad 2.18)
  other vias: 38.1,68.58
N$253  (via drill 0.9 pad 2.18)
  other vias: 35.56,68.58
N$254  (via drill 0.9 pad 2.18)
  other vias: 40.64,68.58
N$255  (via drill 0.9 pad 2.18)
  other vias: 43.18,68.58
N$256  (via drill 0.9 pad 2.18)
  other vias: 86.36,58.42
N$257  (via drill 0.9 pad 2.18)
  other vias: 93.98,63.5
N$258  (via drill 0.9 pad 2.18)
  other vias: 93.98,71.12
N$259  (via drill 0.9 pad 2.18)
  other vias: 76.2,71.12
N$260  (via drill 0.9 pad 2.18)
  other vias: 78.74,71.12
N$261  (via drill 0.9 pad 2.18)
  other vias: 81.28,71.12
N$262  (via drill 0.9 pad 2.18)
  other vias: 83.82,71.12
N$263  (via drill 0.9 pad 2.18)
  other vias: 73.66,68.58
N$264  (via drill 0.9 pad 2.18)
  other vias: 73.66,66.04
N$265  (via drill 0.9 pad 2.18)
  other vias: 71.12,66.04
N$266  (via drill 0.9 pad 2.18)
  other vias: 71.12,63.5
N$267  (via drill 0.9 pad 2.18)
  other vias: 71.12,60.96
N$268  (via drill 0.9 pad 2.18)
  other vias: 71.12,58.42
N$269  (via drill 0.9 pad 2.18)
  other vias: 73.66,58.42
N$270  (via drill 0.9 pad 2.18)
  other vias: 76.2,58.42
N$271  (via drill 0.9 pad 2.18)
  other vias: 76.2,60.96
N$272  (via drill 0.9 pad 2.18)
  other vias: 73.66,63.5
N$273  (via drill 0.9 pad 2.18)
  other vias: 73.66,60.96
N$274  (via drill 0.9 pad 2.18)
  other vias: 76.2,63.5
N$275  (via drill 0.9 pad 2.18)
  other vias: 76.2,66.04
N$276  (via drill 0.9 pad 2.18)
  other vias: 76.2,68.58
N$277  (via drill 0.9 pad 2.18)
  other vias: 78.74,68.58
N$278  (via drill 0.9 pad 2.18)
  other vias: 81.28,68.58
N$279  (via drill 0.9 pad 2.18)
  other vias: 83.82,68.58
N$280  (via drill 0.9 pad 2.18)
  other vias: 86.36,71.12
N$281  (via drill 0.9 pad 2.18)
  other vias: 88.9,71.12
N$282  (via drill 0.9 pad 2.18)
  other vias: 91.44,71.12
N$283  (via drill 0.9 pad 2.18)
  other vias: 91.44,68.58
N$284  (via drill 0.9 pad 2.18)
  other vias: 91.44,66.04
N$285  (via drill 0.9 pad 2.18)
  other vias: 91.44,63.5
N$286  (via drill 0.9 pad 2.18)
  other vias: 88.9,63.5
N$287  (via drill 0.9 pad 2.18)
  other vias: 88.9,66.04
N$288  (via drill 0.9 pad 2.18)
  other vias: 88.9,68.58
N$289  (via drill 0.9 pad 2.18)
  other vias: 86.36,68.58
N$290  (via drill 0.9 pad 2.18)
  other vias: 86.36,66.04
N$291  (via drill 0.9 pad 2.18)
  other vias: 86.36,63.5
N$292  (via drill 0.9 pad 2.18)
  other vias: 86.36,60.96
N$293  (via drill 0.9 pad 2.18)
  other vias: 93.98,66.04
N$294  (via drill 0.9 pad 2.18)
  other vias: 93.98,68.58
N$295  (via drill 0.9 pad 2.18)
  other vias: 50.8,66.04
N$296  (via drill 0.9 pad 2.18)
  other vias: 50.8,63.5
N$297  (via drill 0.9 pad 2.18)
  other vias: 50.8,60.96
N$298  (via drill 0.9 pad 2.18)
  other vias: 50.8,58.42
N$299  (via drill 0.9 pad 2.18)
  other vias: 48.26,58.42
N$300  (via drill 0.9 pad 2.18)
  other vias: 48.26,60.96
N$301  (via drill 0.9 pad 2.18)
  other vias: 48.26,63.5
N$302  (via drill 0.9 pad 2.18)
  other vias: 48.26,66.04
N$328  (via drill 0.9 pad 2.18)
  other vias: 38.1,50.8
N$329  (via drill 0.9 pad 2.18)
  other vias: 38.1,53.34
N$330  (via drill 0.9 pad 2.18)
  other vias: 40.64,53.34
N$331  (via drill 0.9 pad 2.18)
  other vias: 43.18,55.88
N$332  (via drill 0.9 pad 2.18)
  other vias: 38.1,55.88
N$333  (via drill 0.9 pad 2.18)
  other vias: 25.4,68.58
N$334  (via drill 0.9 pad 2.18)
  other vias: 22.86,68.58
N$335  (via drill 0.9 pad 2.18)
  other vias: 20.32,68.58
N$336  (via drill 0.9 pad 2.18)
  other vias: 17.78,68.58
N$337  (via drill 0.9 pad 2.18)
  other vias: 15.24,68.58
N$338  (via drill 0.9 pad 2.18)
  other vias: 12.7,68.58
N$339  (via drill 0.9 pad 2.18)
  other vias: 10.16,66.04
N$340  (via drill 0.9 pad 2.18)
  other vias: 7.62,63.5
N$341  (via drill 0.9 pad 2.18)
  other vias: 10.16,63.5
N$342  (via drill 0.9 pad 2.18)
  other vias: 10.16,58.42
N$343  (via drill 0.9 pad 2.18)
  other vias: 10.16,60.96
N$344  (via drill 0.9 pad 2.18)
  other vias: 7.62,60.96
N$345  (via drill 0.9 pad 2.18)
  other vias: 10.16,50.8
N$346  (via drill 0.9 pad 2.18)
  other vias: 10.16,53.34
N$347  (via drill 0.9 pad 2.18)
  other vias: 10.16,55.88
N$348  (via drill 0.9 pad 2.18)
  other vias: 7.62,55.88
N$349  (via drill 0.9 pad 2.18)
  other vias: 7.62,58.42
N$350  (via drill 0.9 pad 2.18)
  other vias: 7.62,53.34
N$351  (via drill 0.9 pad 2.18)
  other vias: 12.7,50.8
N$352  (via drill 0.9 pad 2.18)
  other vias: 15.24,50.8
N$353  (via drill 0.9 pad 2.18)
  other vias: 17.78,50.8
N$354  (via drill 0.9 pad 2.18)
  other vias: 20.32,50.8
N$355  (via drill 0.9 pad 2.18)
  other vias: 22.86,50.8
N$356  (via drill 0.9 pad 2.18)
  other vias: 25.4,50.8
N$357  (via drill 0.9 pad 2.18)
  other vias: 27.94,50.8
N$358  (via drill 0.9 pad 2.18)
  other vias: 30.48,50.8
N$359  (via drill 0.9 pad 2.18)
  other vias: 33.02,50.8
N$360  (via drill 0.9 pad 2.18)
  other vias: 35.56,50.8
N$361  (via drill 0.9 pad 2.18)
  other vias: 35.56,53.34
N$362  (via drill 0.9 pad 2.18)
  other vias: 35.56,55.88
N$363  (via drill 0.9 pad 2.18)
  other vias: 40.64,55.88
N$364  (via drill 0.9 pad 2.18)
  other vias: 45.72,55.88
N$365  (via drill 0.9 pad 2.18)
  other vias: 48.26,55.88
N$366  (via drill 0.9 pad 2.18)
  other vias: 50.8,55.88
N$367  (via drill 0.9 pad 2.18)
  other vias: 53.34,55.88
N$368  (via drill 0.9 pad 2.18)
  other vias: 53.34,58.42
N$369  (via drill 0.9 pad 2.18)
  other vias: 53.34,60.96
N$370  (via drill 0.9 pad 2.18)
  other vias: 53.34,63.5
N$371  (via drill 0.9 pad 2.18)
  other vias: 53.34,66.04
N$372  (via drill 0.9 pad 2.18)
  other vias: 78.74,66.04
N$373  (via drill 0.9 pad 2.18)
  other vias: 81.28,66.04
N$374  (via drill 0.9 pad 2.18)
  other vias: 83.82,66.04
N$375  (via drill 0.9 pad 2.18)
  other vias: 83.82,63.5
N$376  (via drill 0.9 pad 2.18)
  other vias: 83.82,60.96
N$377  (via drill 0.9 pad 2.18)
  other vias: 83.82,58.42
N$378  (via drill 0.9 pad 2.18)
  other vias: 81.28,58.42
N$379  (via drill 0.9 pad 2.18)
  other vias: 78.74,58.42
N$380  (via drill 0.9 pad 2.18)
  other vias: 78.74,60.96
N$381  (via drill 0.9 pad 2.18)
  other vias: 78.74,63.5
N$382  (via drill 0.9 pad 2.18)
  other vias: 81.28,63.5
N$383  (via drill 0.9 pad 2.18)
  other vias: 81.28,60.96
N$384  (via drill 0.9 pad 2.18)
  other vias: 12.7,53.34
N$385  (via drill 0.9 pad 2.18)
  other vias: 15.24,55.88
N$386  (via drill 0.9 pad 2.18)
  other vias: 17.78,55.88
N$387  (via drill 0.9 pad 2.18)
  other vias: 12.7,55.88
N$388  (via drill 0.9 pad 2.18)
  other vias: 20.32,55.88
N$389  (via drill 0.9 pad 2.18)
  other vias: 22.86,55.88
N$390  (via drill 0.9 pad 2.18)
  other vias: 25.4,55.88
N$391  (via drill 0.9 pad 2.18)
  other vias: 27.94,55.88
N$392  (via drill 0.9 pad 2.18)
  other vias: 30.48,55.88
N$393  (via drill 0.9 pad 2.18)
  other vias: 33.02,55.88
N$394  (via drill 0.9 pad 2.18)
  other vias: 33.02,53.34
N$395  (via drill 0.9 pad 2.18)
  other vias: 30.48,53.34
N$396  (via drill 0.9 pad 2.18)
  other vias: 27.94,53.34
N$397  (via drill 0.9 pad 2.18)
  other vias: 25.4,53.34
N$398  (via drill 0.9 pad 2.18)
  other vias: 22.86,53.34
N$399  (via drill 0.9 pad 2.18)
  other vias: 20.32,53.34
N$400  (via drill 0.9 pad 2.18)
  other vias: 17.78,53.34
N$401  (via drill 0.9 pad 2.18)
  other vias: 15.24,53.34
RESET  (via drill 0.6)
  Top 0.406: v62.87,47.62 62.87,48.58 62.23,49.21 62.23,73.03 62.87,73.66 J8.RESET | C19.2
  Bottom 0.406: v62.87,47.62 78.74,31.75 C19.2 | C19.2
RXD
  Top 0.406: J10.3 95.89,29.21 96.52,28.57 96.52,27.3 93.03,23.81 87,23.81 80.33,17.14 76.2,17.14 74.93,18.41 73.66,18.41 69.85,14.61 66.36,14.61 60.32,20.64 34.61,20.64 32.38,22.86 J8.0_RX
SCK  (via drill 0.6)
  Top 0.406: IC2.13 53.98,41.27 54.29,40.96 54.61,40.64 v64.14,40.64
  Bottom 0.406: v64.14,40.64 67.31,37.46 J8.13
TXD
  Top 0.406: J8.1_TX 34.92,24.77 36.2,23.49 60.01,23.49 62.87,20.64 82.23,20.64 88.9,27.3 92.08,27.3 93.35,28.57 J10.2

### Text on the board
Reference: +5V | +5V | +5V | A5 | A4 | A3 | A2 | A1 | A0 | Vin | GND | GND | +5V | +3.3 | RST | GND | GND | APPLY SOLDER JUMPER | GND | MIXED-SIGNAL GROUNDPLANES | smartenergygroups.com | 4.096 V | 8-channel expansion board | Open Hardware | SERIAL PROGRAMMING / COMMS | CAN BE USED WITH STANDARD ARDUINO | PASS-THROUGH TO MICROCONTROLLER BOARD | Hardware design by Luke Weston, 2011 | DTR | TXD | RXD | +5V | GND | GND | 100 nF | CS | MOSI | MISO | SCK | 0 | 1 | 2 | 3 | 4 | 9 | 10 | 11 | 12 | 13 | GND | 220 k | 220 k | Sensor 5V | 1 uF | 1 uF | 1 uF | 1 uF | 1 uF | 1 uF | 1 uF | 1 uF | 9 | 10 | 11 | 12 | 13 | 14 | 15 | 16